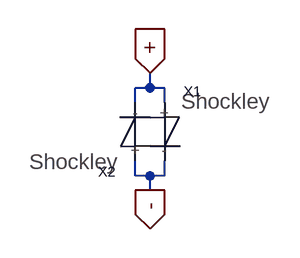
[diagram p0: schematic d30704cx.asc]
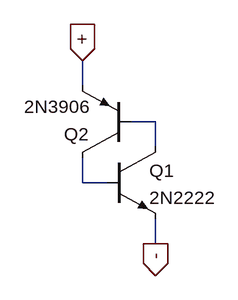
[diagram p1: sub-circuit d30703bx.asc]
d30704cx.asc, the LTspice schematic file:
Version 4
SHEET 1 880 680
WIRE 192 176 192 160
WIRE 192 176 176 176
WIRE 208 176 192 176
WIRE 176 192 176 176
WIRE 208 192 208 176
WIRE 176 272 176 256
WIRE 192 272 176 272
WIRE 208 272 208 256
WIRE 208 272 192 272
WIRE 192 288 192 272
FLAG 192 160 +
IOPIN 192 160 In
FLAG 192 288 -
IOPIN 192 288 Out
SYMBOL d30703bx 192 224 R0
SYMATTR InstName X1
SYMBOL d30703bx 192 224 R180
SYMATTR InstName X2

d30703bx.asc, the sub-circuit schematic file:
Version 4
SHEET 1 880 680
WIRE -32 160 -32 128
WIRE 64 208 32 208
WIRE 64 240 64 208
WIRE -32 288 -32 256
WIRE 0 288 -32 288
WIRE 64 368 64 336
FLAG -32 128 +
IOPIN -32 128 In
FLAG 64 368 -
IOPIN 64 368 Out
SYMBOL npn 0 240 R0
SYMATTR InstName Q1
SYMATTR Value 2N2222
SYMBOL pnp 32 256 R180
SYMATTR InstName Q2
SYMATTR Value 2N3906

The netlist it stands for:
* d30704cx.asc
XX1 + - d30703bx
XX2 - + d30703bx

* block symbol definitions
.subckt d30703bx + -
Q1 N001 N002 - 0 2N2222
Q2 N002 N001 + 0 2N3906
.ends d30703bx

.model NPN NPN
.model PNP PNP
.lib standard.bjt
.backanno
.end